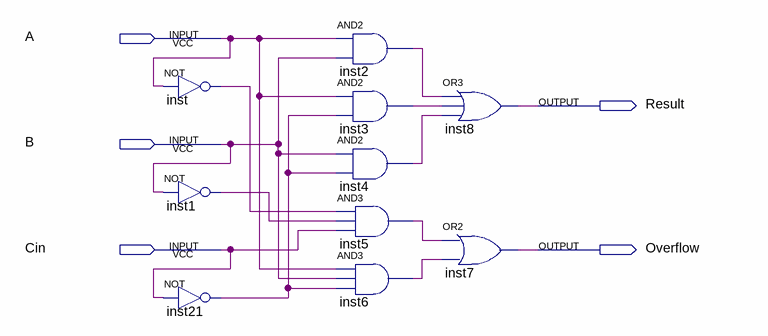
[diagram p0: schematic sheet]
// Quartus schematic Signal.bdf as structural Verilog: 10 symbols, 5 pins
module Signal (
  input  A,
  input  B,
  input  Cin,
  output Result,
  output Overflow
);

  wire inst1_out, inst2_out, inst3_out, inst4_out, inst5_out, inst6_out, inst21_out, inst_out;

  not inst (inst_out, A);
  not inst1 (inst1_out, B);
  not inst21 (inst21_out, Cin);
  and inst2 (inst2_out, A, B);
  and inst3 (inst3_out, A, inst21_out);
  and inst4 (inst4_out, B, inst21_out);
  and inst5 (inst5_out, inst_out, inst1_out, Cin);
  and inst6 (inst6_out, A, B, inst21_out);
  or inst8 (Result, inst2_out, inst3_out, inst4_out);
  or inst7 (Overflow, inst5_out, inst6_out);
endmodule
